# EAGLE design LoRa-E5-Click (EAGLE 9.6.2)
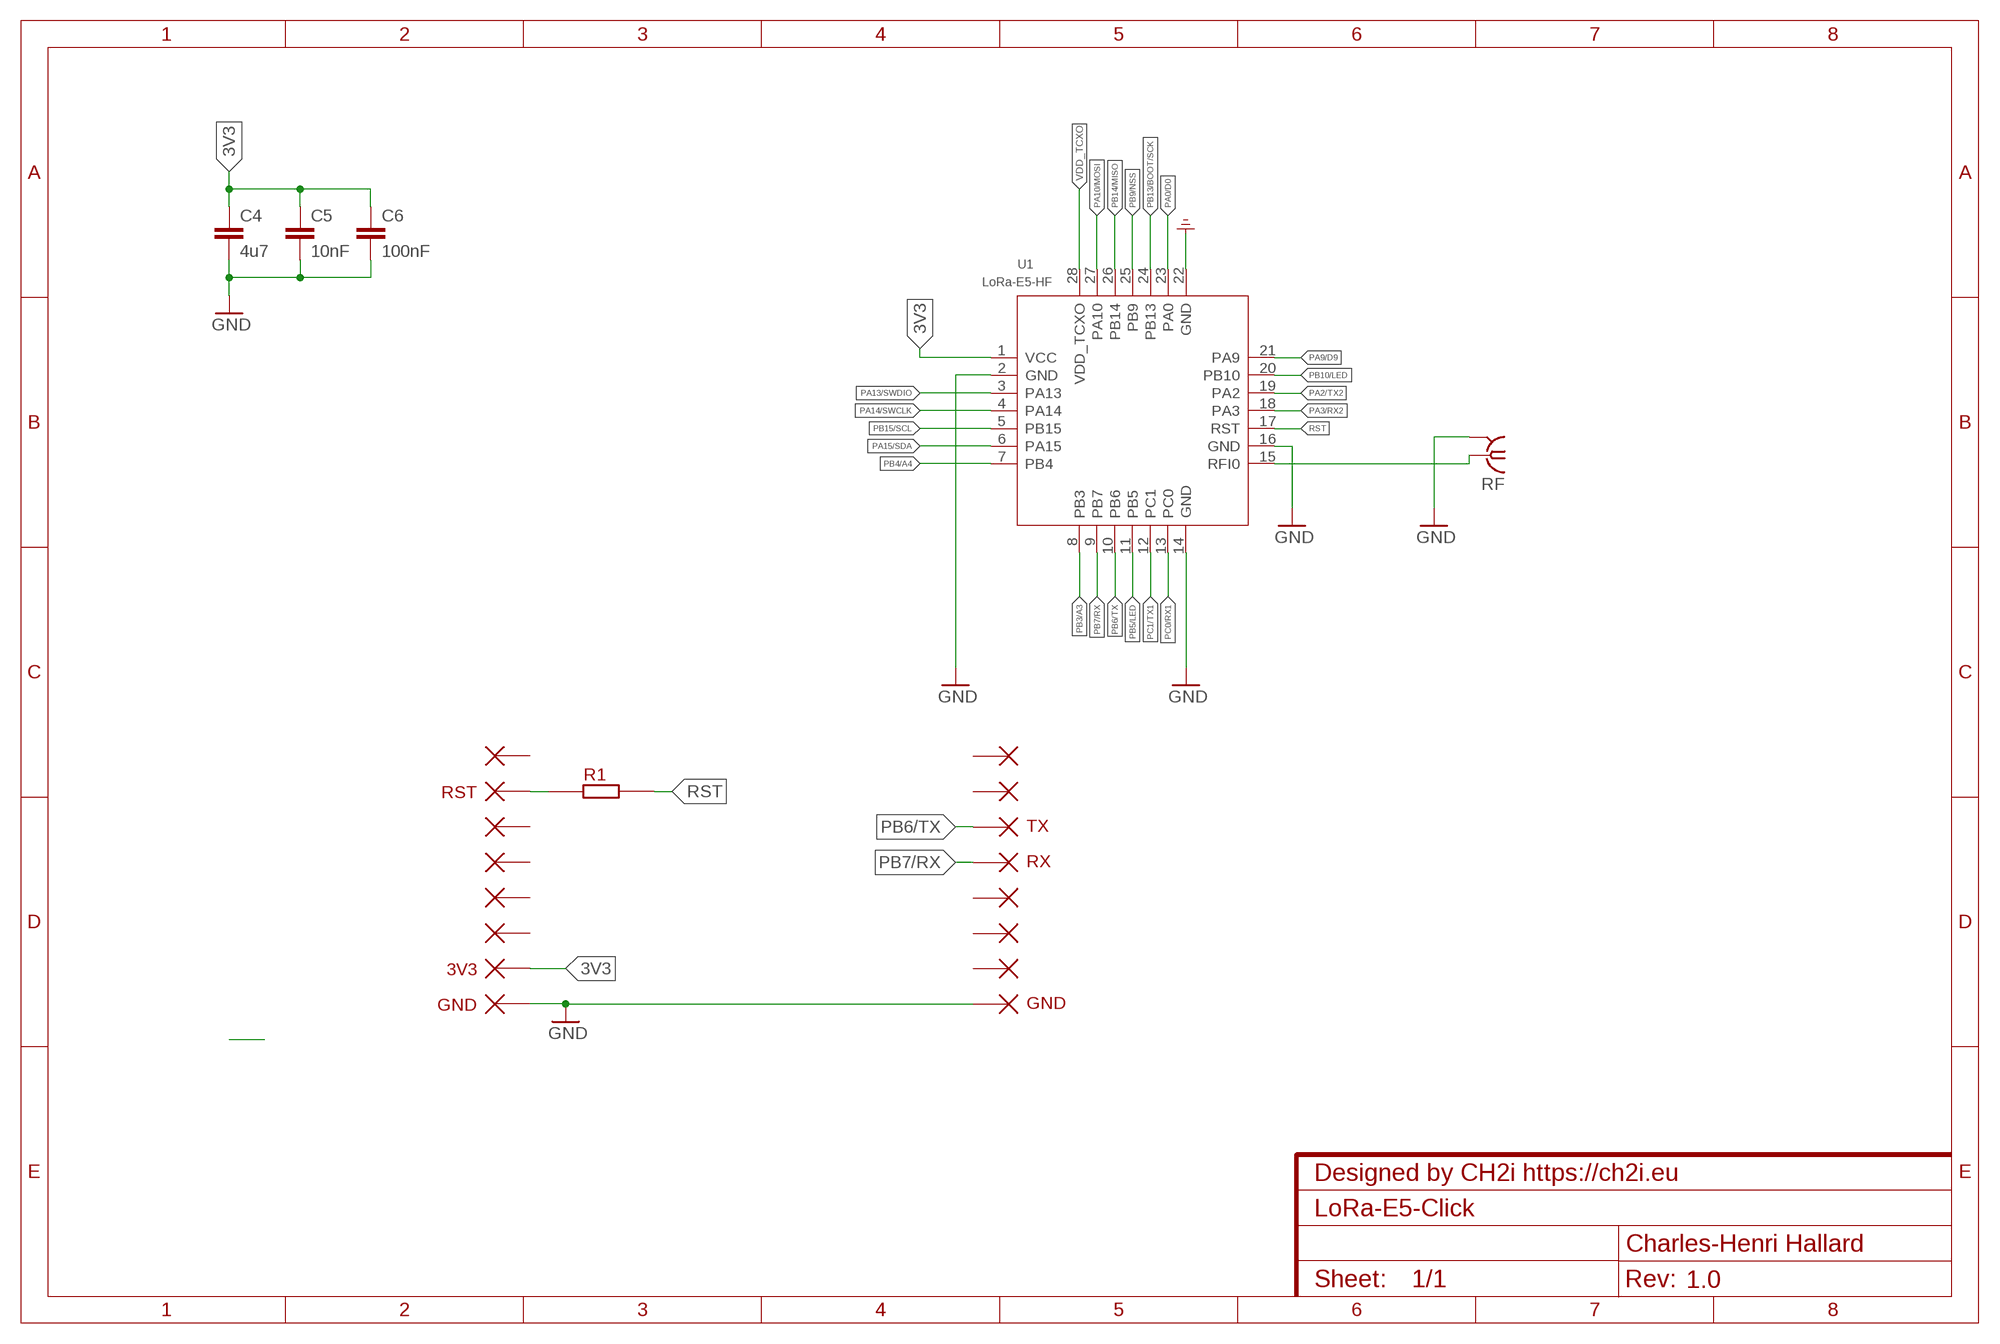
[diagram p0: schematic, sheet 1]
NAME (FRAME-A4L): CNAME: Designed by CH2i https://ch2i.eu; CREVISION: 1.0; DESIGNER: Charles-Henri Hallard

## Parts
C4  4u7  SMD-C-1206  [C1206]
C5  10nF  SMD-C-1206  [C1206]
C6  100nF  SMD-C-1206  [C1206]
P2  PIN  [PIN]
P3  RST  PIN  [PIN]
P7  PIN  [PIN]
P8  PIN  [PIN]
P9  PIN  [PIN]
P10  PIN  [PIN]
P11  3V3  PIN  [PIN]
P12  GND  PIN  [PIN]
P13  PIN  [PIN]
P14  PIN  [PIN]
P15  TX  PIN  [PIN]
P16  RX  PIN  [PIN]
P17  PIN  [PIN]
P18  PIN  [PIN]
P19  PIN  [PIN]
P20  GND  PIN  [PIN]
R1  SMD-RR0603  [R0603]
RF  SMAU.FL  [U.FL_SMT]
U1  LoRa-E5-HF  MOUDLE_LORA_E5  [MOUDLE28P-1.25-12X12X2.5MM]

## Nets
3V3: C4.1 C5.1 C6.1 P11.P$1 U1.1(VCC)
GND: C4.2 C5.2 C6.2 P12.P$1 P20.P$1 RF.GND1(SHIELD) RF.GND2(SHIELD) U1.2(GND) U1.14(GND) U1.16(GND) U1.22(GND) ; supply symbol labelled GND_POWER
N$2: RF.SIG(ANT) U1.15(RFI0)
N$4: P3.P$1 R1.1
PA0/D0: U1.23(PA0)
PA2/TX2: U1.19(PA2)
PA3/RX2: U1.18(PA3)
PA9/D9: U1.21(PA9)
PA10/MOSI: U1.27(PA10)
PA13/SWDIO: U1.3(PA13)
PA14/SWCLK: U1.4(PA14)
PA15/SDA: U1.6(PA15)
PB3/A3: U1.8(PB3)
PB4/A4: U1.7(PB4)
PB5/LED: U1.11(PB5)
PB6/TX: P15.P$1 U1.10(PB6)
PB7/RX: P16.P$1 U1.9(PB7)
PB9/NSS: U1.25(PB9)
PB10/LED: U1.20(PB10)
PB13/BOOT/SCK: U1.24(PB13)
PB14/MISO: U1.26(PB14)
PB15/SCL: U1.5(PB15)
PC0/RX1: U1.13(PC0)
PC1/TX1: U1.12(PC1)
RST: R1.2 U1.17(RST)
VDD_TCXO: U1.28(VDD_TCXO)
Unconnected: P2.P$1 P7.P$1 P8.P$1 P9.P$1 P10.P$1 P13.P$1 P14.P$1 P17.P$1 P18.P$1 P19.P$1

## Library data of the parts
C4-C6 = Standardbauteile:SMD-C-1206
P2 P3 P7-P20 = Mechanik:PIN
R1 = Standardbauteile:SMD-R
RF = Mechanik:SMA
U1 = moudle-new:MOUDLE_LORA_E5

## Board
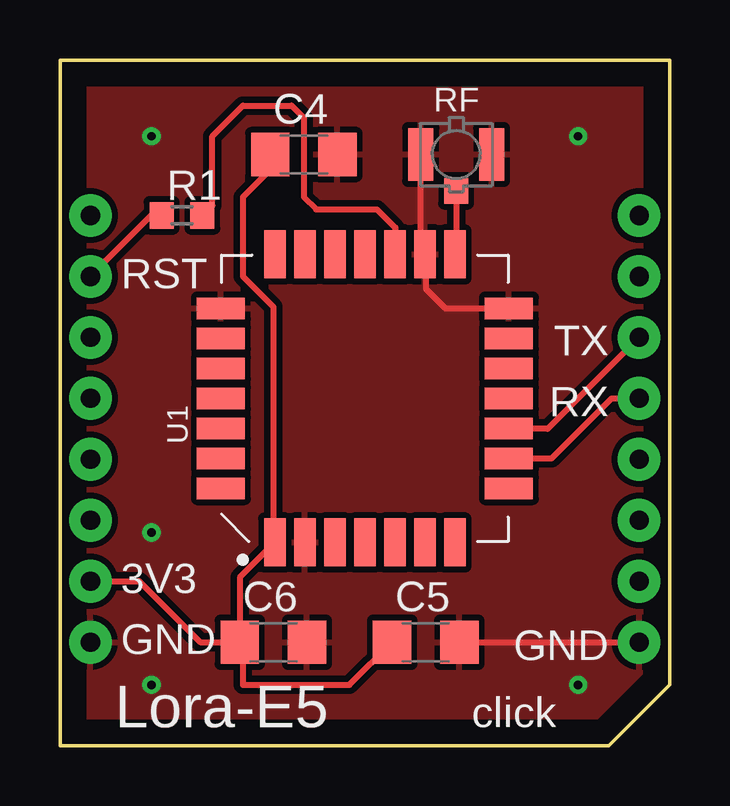
[diagram p1: board, top side]
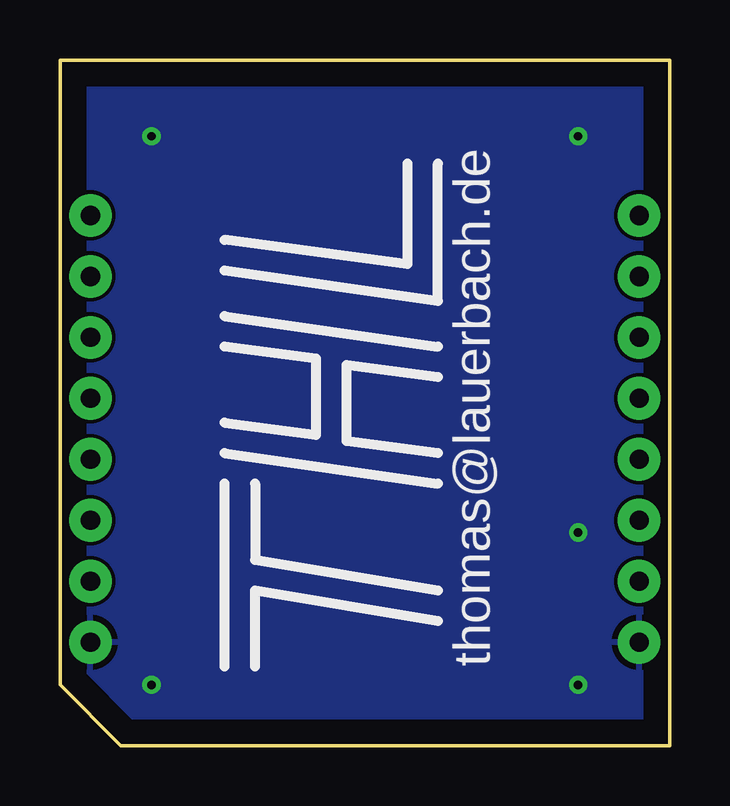
[diagram p2: board, bottom side, seen from below]

Size 25.4 x 28.57 mm. Coordinates in mm from the lower left corner, seen from the top.
Outline: 0,0 22.86,0 25.4,2.54 25.4,28.57 0,28.57 0,0
Copper layers (1*16): Top 0.035mm / dielectric 1.5mm / Bottom 0.035mm
Design rules "default": minimum track width 6mil, minimum drill 0.35mm, track to track 6mil, track to pad 6mil, pad to pad 6mil, via to via 6mil, smd to smd 6mil, copper to edge 40mil, drill to drill 6mil, minimum pad ring 10mil, minimum via ring 8mil, stop-mask expansion 4mil, vias tented up to drill 0mil, thermal gap 10mil

### Footprints (pad centres in the part's own frame; a part is rotated, then mirrored left to right if it is on the bottom)
C1206 = smd 1.6 x 1.8: 1 -1.4,0; 2 1.4,0
PIN = drill 0.8 pad 1.778: P$1 0,0
R0603 = smd 1 x 1.1: 1 -0.85,0; 2 0.85,0
U.FL_SMT = smd 1.05 x 2.2: GND1 -1.475,0; GND2 1.475,0 | smd 1 x 1.05: SIG 0,-1.525
MOUDLE28P-1.25-12X12X2.5MM = smd 2 x 0.9: 1 -6,3.75; 2 -6,2.5; 3 -6,1.25; 4 -6,0; 5 -6,-1.25; 6 -6,-2.5; 7 -6,-3.75; 15 6,-3.75; 16 6,-2.5; 17 6,-1.25; 18 6,0; 19 6,1.25; 20 6,2.5; 21 6,3.75 | smd 0.9 x 2: 8 -3.75,-6; 9 -2.5,-6; 10 -1.25,-6; 11 0,-6; 12 1.25,-6; 13 2.5,-6; 14 3.75,-6; 22 3.75,6; 23 2.5,6; 24 1.25,6; 25 0,6; 26 -1.25,6; 27 -2.5,6; 28 -3.75,6

### Placement (x,y rotation side)
C4  10.16,24.64 0 top
C5  15.24,4.32 0 top
C6  8.89,4.32 0 top
P2  24.13,11.94 0 top
P3  1.27,19.56 0 top
P7  24.13,19.56 0 top
P8  1.27,9.4 0 top
P9  1.27,11.94 0 top
P10  1.27,14.48 0 top
P11  1.27,6.86 0 top
P12  1.27,4.32 0 top
P13  1.27,17.02 0 top
P14  24.13,22.1 0 top
P15  24.13,17.02 180 top
P16  24.13,14.48 180 top
P17  1.27,22.1 0 top
P18  24.13,6.86 0 top
P19  24.13,9.4 0 top
P20  24.13,4.32 180 top
R1  5.08,22.1 0 top
RF  16.51,24.64 0 top
U1  12.7,14.48 90 top
U$2  [THL]  13.46,13.46 90 bottom

### Tracks (layer width: path | path; a pad name or v marks a point on that pad's centre or on a via)
3V3
  Top 0.254: C6.1 7.49,7.02 U1.1 8.89,8.54 8.89,18.29 7.62,19.56 7.62,22.86 8.76,24 C4.1 | P11.P$1 3.3,6.86 5.84,4.32 C6.1 | C6.1 7.62,4.19 7.62,2.54 12.06,2.54 C5.1
GND  (via drill 0.35)
  Top 0.254: U1.14 16.06,18.23 15.24,19.05 15.24,20.44 U1.16 15.04,20.64 RF.GND1 | C5.2 P20.P$1 | 10.29,3.94 C6.2
  other vias: 3.81,2.54 21.59,2.54 3.81,25.4 21.59,25.4 3.81,8.89
  pour Top (isolate 0.254): 0,0 22.86,0 25.4,2.54 25.4,27.94 0,27.94
  pour Bottom: 0,27.94 25.4,27.94 25.4,2.54 22.86,0 0,0
N$2
  Top 0.254: RF.SIG 16.51,20.54 U1.15
N$4
  Top 0.254: 1.69,19.56 P3.P$1 3.81,22.1 R1.1
PB6/TX
  Top 0.254: U1.10 20.3,13.23 20.32,13.21 P15.P$1
PB7/RX
  Top 0.254: U1.9 20.49,11.98 22.99,14.48 P16.P$1
RST
  Top 0.254: R1.2 6.35,22.52 6.35,25.4 7.62,26.67 9.65,26.67 10.16,26.16 10.16,22.86 10.67,22.35 13.21,22.35 13.97,21.59 13.97,20.5 U1.17

### Text on the board
tNames: Lora-E5 | click